# Altium schematic sheet Блок1.SchDoc
size A4; SheetNumber: 12; SheetTotal: 13
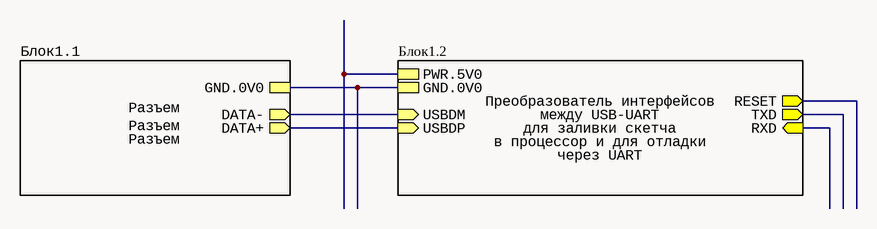
[diagram p0: Блок1.SchDoc]

## Sub-sheets
Блок1.1 = Блок1.1.SchDoc: DATA+ (out), GND.0V0, DATA- (out)  | Parameter 1: Разъем; Parameter 2: Разъем; Parameter 3: Разъем
Блок1.2 = Блок1.2.SchDoc: TXD (out), USBDM (in), USBDP (in), RXD (in), RESET (out), PWR.5V0, GND.0V0  | Parameter 1: между USB-UART; Parameter 2: для заливки скетча; Parameter 3: в процессор и для отладки; Parameter 4: Преобразователь интерфейсов; Parameter 5: через UART

## Nets
(unnamed): sheet Блок1.2/USBDM, sheet Блок1.1/DATA-
(unnamed): sheet Блок1.2/USBDP, sheet Блок1.1/DATA+
(unnamed): sheet Блок1.2/GND.0V0, sheet Блок1.1/GND.0V0